# Altium schematic sheet Block_Diagram.SchDoc
size A3; SheetNumber: 1; SheetTotal: 9
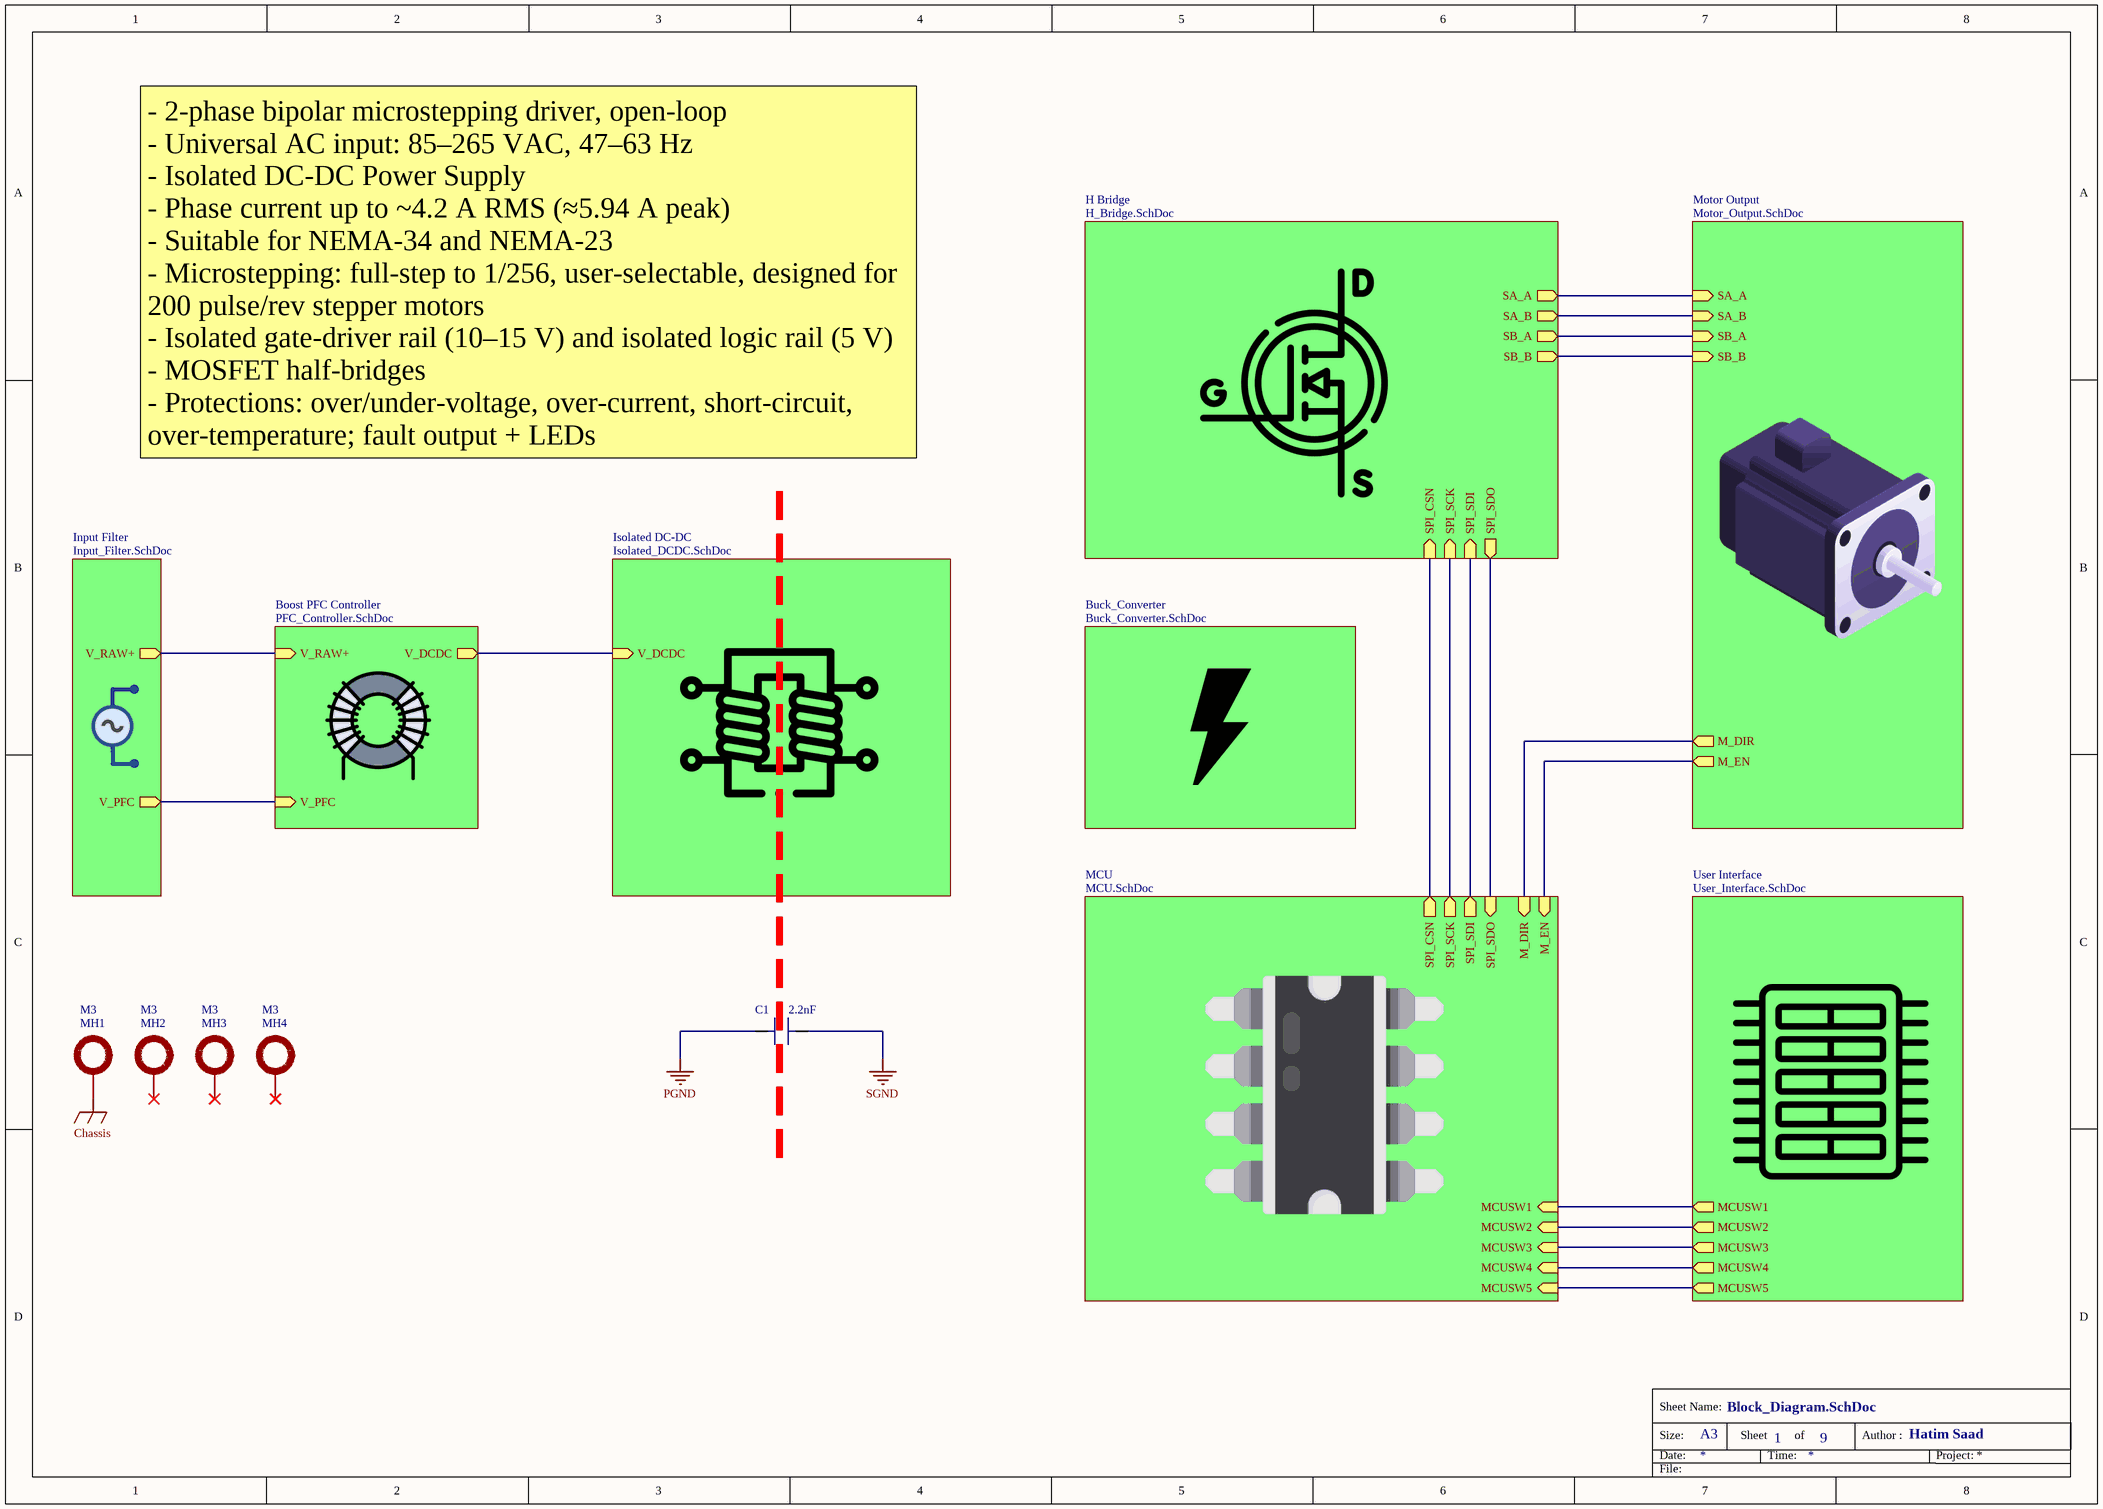
[diagram p0: Block_Diagram.SchDoc]

## Parts
C1  2.2nF  [C10MM]
MH1  M3  [M3 Mounting Hole]  (no BOM)
MH2  M3  [M3 Mounting Hole]  (no BOM)
MH3  M3  [M3 Mounting Hole]  (no BOM)
MH4  M3  [M3 Mounting Hole]  (no BOM)

## Sub-sheets
Boost PFC Controller = PFC_Controller.SchDoc: V_RAW+ (in), V_PFC (in), V_DCDC (out)
Buck_Converter = Buck_Converter.SchDoc: no entries
H Bridge = H_Bridge.SchDoc: SPI_CSN (in), SPI_SCK (in), SPI_SDI (in), SPI_SDO (out), SA_A (out), SA_B (out), SB_A (out), SB_B (out)
Input Filter = Input_Filter.SchDoc: V_RAW+ (out), V_PFC (out)
Isolated DC-DC = Isolated_DCDC.SchDoc: V_DCDC (in)
MCU = MCU.SchDoc: SPI_CSN (out), SPI_SCK (out), SPI_SDI (out), SPI_SDO (in), MCUSW5 (in), MCUSW4 (in), MCUSW3 (in), MCUSW2 (in), MCUSW1 (in), M_DIR (in), M_EN (in)
Motor Output = Motor_Output.SchDoc: SA_A (in), SA_B (in), SB_A (in), SB_B (in), M_DIR (out), M_EN (out)
User Interface = User_Interface.SchDoc: MCUSW5 (out), MCUSW4 (out), MCUSW3 (out), MCUSW2 (out), MCUSW1 (out)

## Nets
Chassis: MH1.1
PGND: C1.1(A)
SGND: C1.2(B)
(unnamed): sheet Input Filter/V_RAW+, sheet Boost PFC Controller/V_RAW+
(unnamed): sheet Input Filter/V_PFC, sheet Boost PFC Controller/V_PFC
(unnamed): sheet Boost PFC Controller/V_DCDC, sheet Isolated DC-DC/V_DCDC
(unnamed): sheet H Bridge/SPI_CSN, sheet MCU/SPI_CSN
(unnamed): sheet H Bridge/SPI_SCK, sheet MCU/SPI_SCK
(unnamed): sheet H Bridge/SPI_SDI, sheet MCU/SPI_SDI
(unnamed): sheet H Bridge/SPI_SDO, sheet MCU/SPI_SDO
(unnamed): sheet H Bridge/SA_A, sheet Motor Output/SA_A
(unnamed): sheet H Bridge/SA_B, sheet Motor Output/SA_B
(unnamed): sheet H Bridge/SB_A, sheet Motor Output/SB_A
(unnamed): sheet H Bridge/SB_B, sheet Motor Output/SB_B
(unnamed): sheet MCU/MCUSW5, sheet User Interface/MCUSW5
(unnamed): sheet MCU/MCUSW4, sheet User Interface/MCUSW4
(unnamed): sheet MCU/MCUSW3, sheet User Interface/MCUSW3
(unnamed): sheet MCU/MCUSW2, sheet User Interface/MCUSW2
(unnamed): sheet MCU/MCUSW1, sheet User Interface/MCUSW1
(unnamed): sheet MCU/M_DIR, sheet Motor Output/M_DIR
(unnamed): sheet MCU/M_EN, sheet Motor Output/M_EN

Not connected (* = marked no-connect by the designer): MH2 1*; MH3 1*; MH4 1*

## Notes on the sheet
- - 2-phase bipolar microstepping driver, open-loop
  - Universal AC input: 85–265 VAC, 47–63 Hz
  - Isolated DC-DC Power Supply
  - Phase current up to ~4.2 A RMS (≈5.94 A peak)
  - Suitable for NEMA-34 and NEMA-23
  - Microstepping: full-step to 1/256, user-selectable, designed for 200 pulse/rev stepper motors
  - Isolated gate-driver rail (10–15 V) and isolated logic rail (5 V)
  - MOSFET half-bridges
  - Protections: over/under-voltage, over-current, short-circuit, over-temperature; fault output + LEDs
  - EMC Standards
- Size:
- Date:
- Sheet Name:
- A3
- Sheet
- Time:
- of
- Author :
- Hatim Saad
- Project:
- File:

## Library data of the parts
C1 = CD45-E2GA222M-NKA: Safety Capacitors D: 9mm X1/Y1 2200pF E 20% LS:10mm; Supplier 1: Mouser; Supplier Part Number 1: 810-CD45-E2GA222MNKA
MH1-MH4 = Mounting Hole M3: Mounting Hole M3 Screw